# EAGLE schematic SWD_PROGRAMMER (EAGLE 6.5.0)
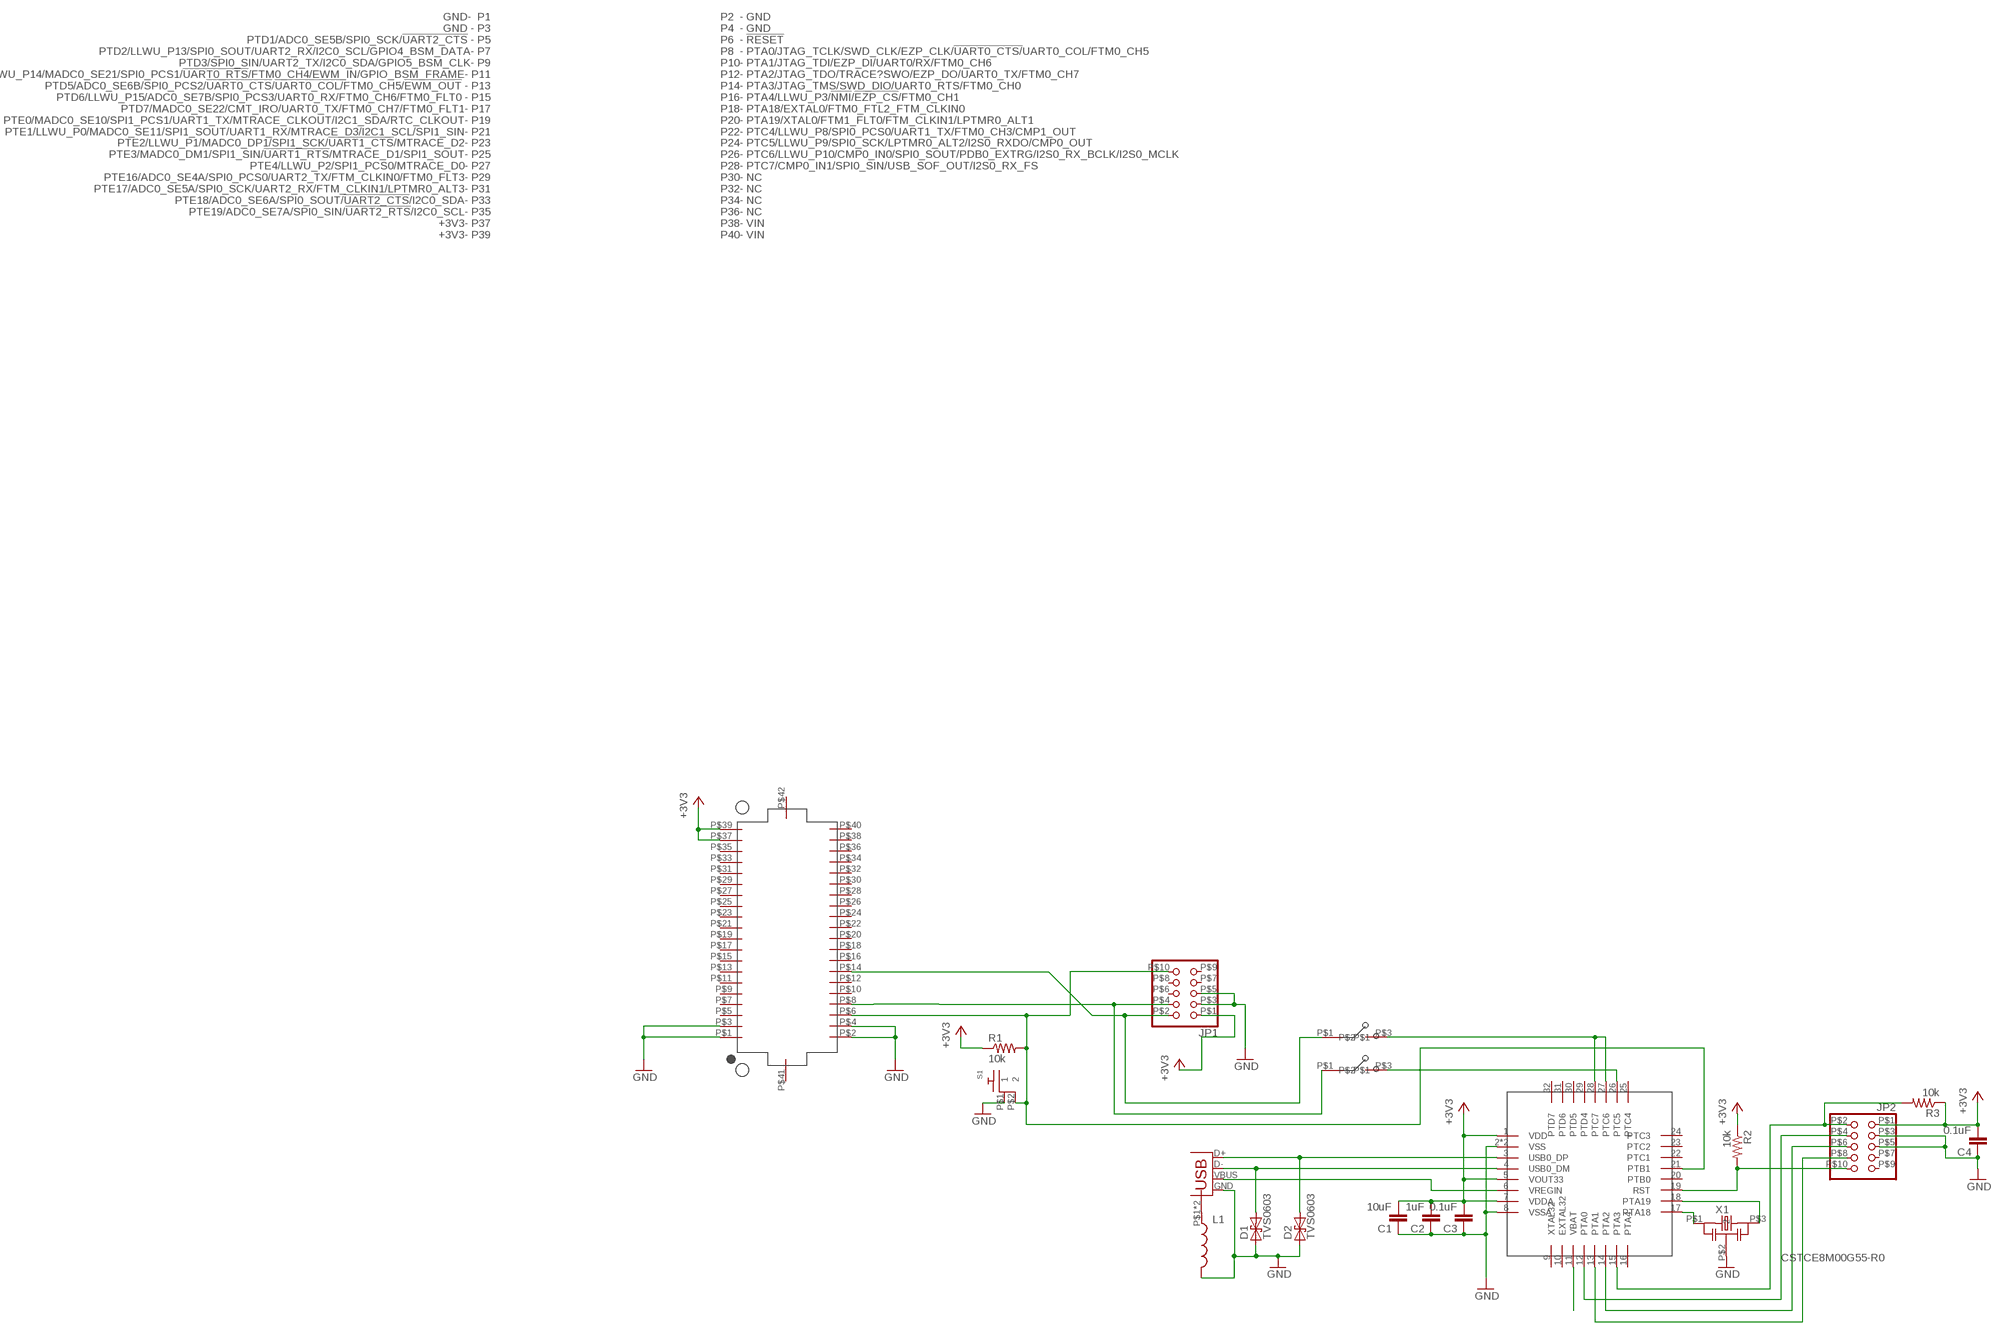
[diagram p0: schematic, sheet 1]

## Parts
C1  10uF  RF-C0805  [C0805]
C2  1uF  RF-C0805  [C0805]
C3  0.1uF  RF-C0805  [C0805]
C4  0.1uF  RF-C0805  [C0805]
D1  TVS0603  [0603-RES]
D2  TVS0603  [0603-RES]
J1  USB_B  [USB-B-PTH-VERTICAL]
JP1  PINHD-2X5SMALL  [2X5HDR]
JP2  PINHD-2X5SMALL  [2X5HDR]
L1  INDUCTOR0603  [0603]
R1  10k  RF-R0805  [RF-C0805]
R2  10k  RF-R0805  [RF-C0805]
R3  10k  RF-R0805  [RF-C0805]
S1  RA_BUTTON  [RA_BUTTON]
SW1  CJS  [CJS]
SW2  CJS  [CJS]
U1  KW2_CPU_OFFSET  [BRAIN_OFFSET]
U2  KL20PAD  [QFN-32]
X1  CSTCE8M00G55-R0  [CSTCE_G_A]

## Nets
+3V3: C1.2 C2.2 C3.2 C4.2 JP1.P$1 JP2.P$1 R1.1 R2.1 R3.1 U1.P$37(+3V3) U1.P$39(+3V3) U2.1(VDD) U2.5(VOUT33) U2.7(VDDA)
CLK: JP2.P$4 U2.12(PTA0)
GND [GND]: C1.1 C2.1 C3.1 C4.1 D1.1 D2.1 J1.GND JP1.P$3 JP1.P$5 JP2.P$3 JP2.P$5 L1.2 S1.P$1 U1.P$1(GND) U1.P$2(GND) U1.P$3(GND) U1.P$4(GND) U2.2(VSS) U2.8(VSSA) U2.EP(VSS) X1.P$2
JRST: JP2.P$10 R2.2 U2.19(RST)
N$1: SW1.P$3 U2.27(PTC6) U2.28(PTC7)
N$2: J1.VBUS U2.6(VREGIN)
N$3: U2.11(VBAT)
N$4: U2.17(PTA18) X1.P$1
N$5: J1.P$1(SHIELD) J1.P$2(SHIELD) L1.1
N$6: U2.18(PTA19) X1.P$3
N$35: D1.2 J1.D- U2.4(USB0_DM)
N$36: D2.2 J1.D+ U2.3(USB0_DP)
RST: JP1.P$10 R1.2 S1.P$2 U1.P$6(!RESET) U2.21(PTB1)
SWD_CLK: JP1.P$4 SW2.P$1 U1.P$8(PTA0/JTAG_TCLK/SWD_CLK/EZP_CLK/!UART0_CTS/!UART0_COL/FTM0_CH5)
SWD_DIO: JP1.P$2 SW1.P$1 U1.P$14(PTA3/JTAG_TMS/SWD_DIO/UART0_RTS/FTM0_CH0)
SWD_TGT_CLK: SW2.P$3 U2.26(PTC5)
TDI: JP2.P$8 U2.13(PTA1)
TDO: JP2.P$6 U2.14(PTA2)
TMS: JP2.P$2 R3.2 U2.15(PTA3)
Unconnected: JP1.P$6 JP1.P$7 JP1.P$8 JP1.P$9 JP2.P$7 JP2.P$9 U1.P$5(PTD1/ADC0_SE5B/SPI0_SCK/!UART2_CTS) U1.P$7(PTD2/LLWU_P13/SPI0_SOUT/UART2_RX/I2C0_SCL/GPIO4_BSM_DATA) U1.P$9(PTD3/SPI0_SIN/UART2_TX/I2C0_SDA/GPIO5_BSM_CLK) U1.P$10(PTA1/JTAG_TDI/EZP_DI/UART0/RX/FTM0_CH6) U1.P$11(PTD4/LLWU_P14/MADC0_SE21/SPI0_PCS1/!UART0_RTS!/FTM0_CH4/EWM_IN/GPIO_BSM_FRAME) U1.P$12(PTA2/JTAG_TDO/TRACE?SWO/EZP_DO/UART0_TX/FTM0_CH7) U1.P$13(PTD5/ADC0_SE6B/SPI0_PCS2/!UART0_CTS!/!UART0_COL!/FTM0_CH5/!EWM_OUT) U1.P$15(PTD6/LLWU_P15/ADC0_SE7B/SPI0_PCS3/UART0_RX/FTM0_CH6/FTM0_FLT0) U1.P$16(PTA4/LLWU_P3/!NMI!/!EZP_CS!/FTM0_CH1) U1.P$17(PTD7/MADC0_SE22/CMT_IRO/UART0_TX/FTM0_CH7/FTM0_FLT1) U1.P$18(PTA18/EXTAL0/FTM0_FTL2_FTM_CLKIN0) U1.P$19(PTE0/MADC0_SE10/SPI1_PCS1/UART1_TX/MTRACE_CLKOUT/I2C1_SDA/RTC_CLKOUT) U1.P$20(PTA19/XTAL0/FTM1_FLT0/FTM_CLKIN1/LPTMR0_ALT1) U1.P$21(PTE1/LLWU_P0/MADC0_SE11/SPI1_SOUT/UART1_RX/MTRACE_D3/I2C1_SCL/SPI1_SIN) U1.P$22(PTC4/LLWU_P8/SPI0_PCS0/UART1_TX/FTM0_CH3/CMP1_OUT) U1.P$23(PTE2/LLWU_P1/MADC0_DP1/SPI1_SCK/!UART1_CTS!/MTRACE_D2) U1.P$24(PTC5/LLWU_P8/SPI0_PCS0/UART1_TX/FTM0_CH3/CMP1_OUT) U1.P$25(PTE3/MADC0_DM1/SPI1_SIN/!UART1_RTS!/MTRACE_D1/SPI1_SOUT) U1.P$26(PTC6/LLWU_P10/CMP0_IN0/SPI0_SOUT/PDB0_EXTRG/I2S0_RX_BCLK/I2S0_MCLK) U1.P$27(PTE4/LLWU_P2/SPI1_PCS0/MTRACE_D0) U1.P$28(PTC7/CMP0_IN1/SPI0_SIN/USB_SOF_OUT/I2S0_RX_FS) U1.P$29(PTE16/ADC0_SE4A/SPI0_PCS0/UART2_TX/FTM_CLKIN0/FTM0_FLT3) U1.P$30(NC) U1.P$31(PTE17/ADC0_SE5A/SPI0_SCK/UART2_RX/FTM_CLKIN1/LPTMR0_ALT3) U1.P$32(NC) U1.P$33(PTE18/ADC0_SE6A/SPI0_SOUT/!UART2_CTS!/I2C0_SDA) U1.P$34(NC) U1.P$35(PTE19/ADC0_SE7A/SPI0_SIN/!UART2_RTS!/I2C0_SCL) U1.P$36(NC) U1.P$38(VIN) U1.P$40(VIN) U1.P$41 U1.P$42 U2.9(XTAL32) U2.10(EXTAL32) U2.16(PTA4) U2.20(PTB0) U2.22(PTC1) U2.23(PTC2) U2.24(PTC3) U2.25(PTC4) U2.29(PTD4) U2.30(PTD5) U2.31(PTD6) U2.32(PTD7)

## Library data of the parts
C1 = GW-devices:RF-C: RF capacitor pads for FSL reference design; MFGN: Murata; MFGP: GRM219R61E106KA12D
C2 = GW-devices:RF-C: RF capacitor pads for FSL reference design; MFGN: TDK; MFGP: C2012X5R1E105K125AA
C3 C4 = GW-devices:RF-C: RF capacitor pads for FSL reference design; MFGN: TDK; MFGP: C2012X5R1H104K085AA
D1 D2 = SparkFun:TVS; MFGN: Eaton Bussman; MFGP: 0603ESDA2-TR2
J1 = KW2:USB_B; MFGN: Harwin; MFGP: M701-330442
JP1 JP2 = KW2:PINHD-2X5: PIN HEADER; MFGN: Sullins Connector Solutions; MFGP: GRPB052VWVN-RC
L1 = SparkFun:INDUCTOR: Inductors Basic Inductor/Choke - 0603 and 1206. Footprints are not proven and vary greatly between part numbers.; MFGN: TDK; MFGP: MPZ1608S331ATA00
R1-R3 = GW-devices:RF-R: RF resistor pads for FSL reference design; MFGN: Vishay Dale; MFGP: CRCW080510K0FKEA
S1 = KW2:RA_BUTTON
SW1 SW2 = KW2:CJS; MFGN: Copal Electronics Inc; MFGP: CJS-1200TA
U1 = KW2:KW2_CPU
U2 = KW2:KL20; MFGN: Freescale; MFGP: MK20DX128VFM5
X1 = KW2:CSTCE8M00G55-R0